# Altium project PPG_reconstruct.PrjPcb
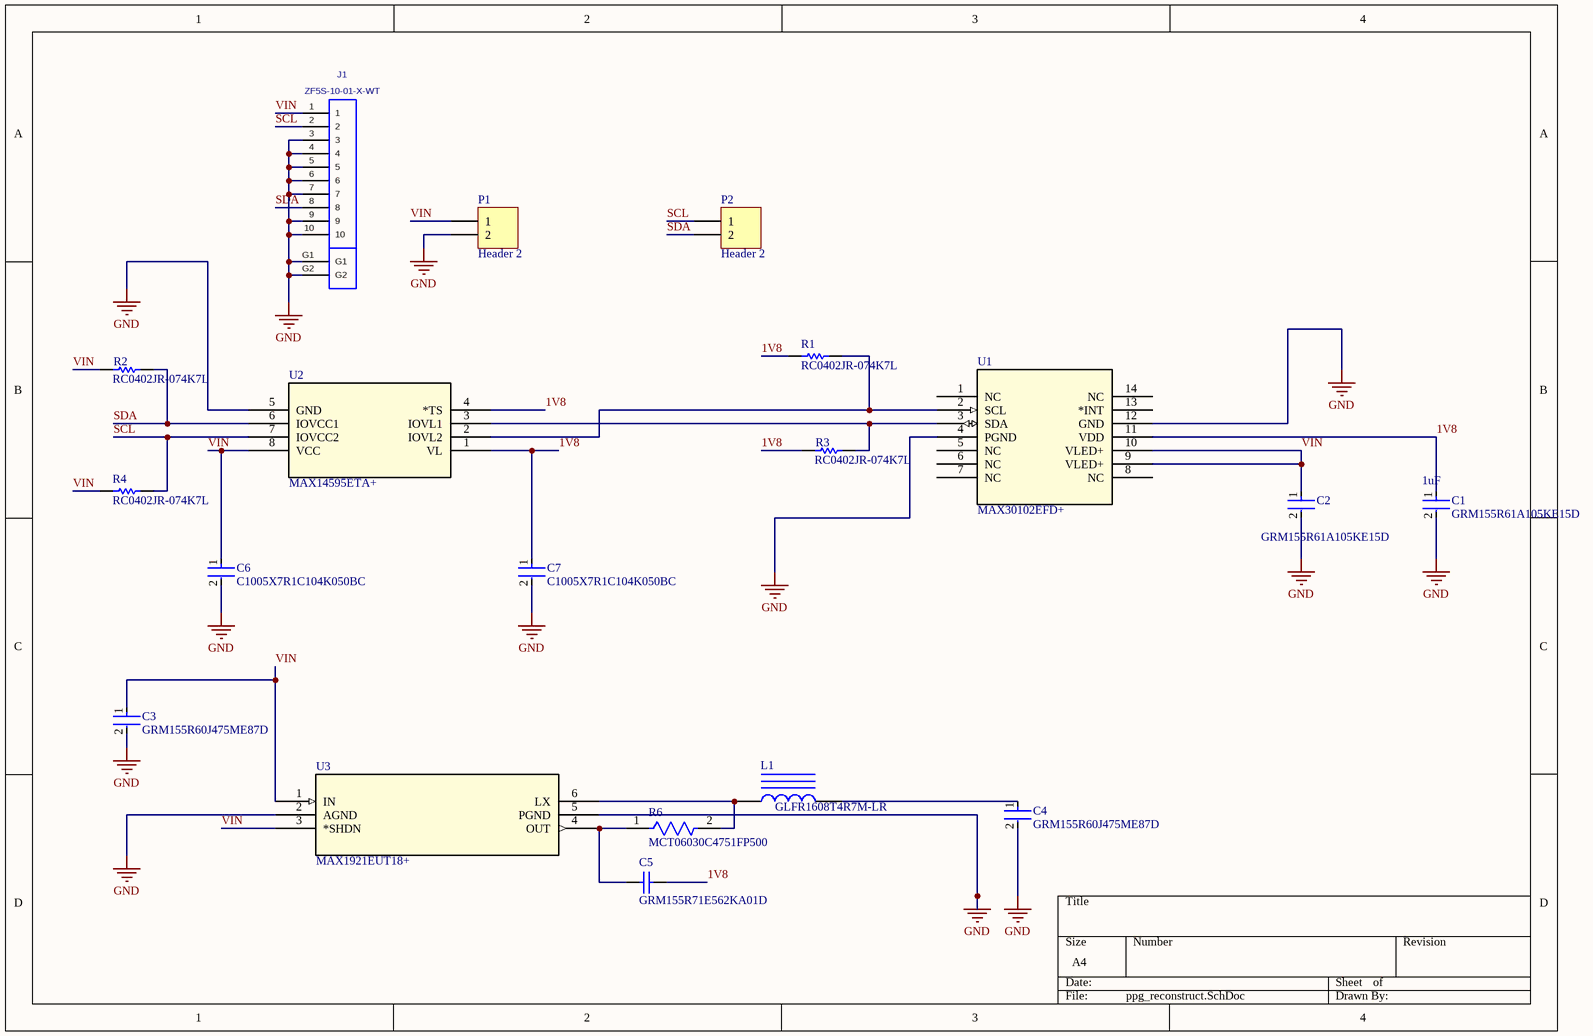
[diagram p0: ppg_reconstruct.SchDoc]
1 sheet, 19 parts. Net scope: global (net labels, ports and power ports of the same name join across sheets).
Board file: ppg_reconstruct.PcbDoc

## Sheet ppg_reconstruct.SchDoc
size A4; SheetNumber: 1; SheetTotal: 1

### Parts
C1  GRM155R61A105KE15D  value 1uF  [FP-GRM15-0_1-MFG]
C2  GRM155R61A105KE15D  [FP-GRM15-0_1-MFG]
C3  GRM155R60J475ME87D  [FP-GRM155-0_15-MFG]
C4  GRM155R60J475ME87D  [FP-GRM155-0_15-MFG]
C5  GRM155R71E562KA01D  [CAPC1005X55X25ML05T10]
C6  C1005X7R1C104K050BC  [FP-C1005-050-0_05-MFG]
C7  C1005X7R1C104K050BC  [FP-C1005-050-0_05-MFG]
J1  ZF5S-10-01-X-WT  [ZF5S-10-01-X-WT]
L1  GLFR1608T4R7M-LR  [INDC1608X100X35LL20T15]
P1  Header 2  [HDR1X2]
P2  Header 2  [HDR1X2]
R1  RC0402JR-074K7L  [RESC1005X40X25LL05T10]
R2  RC0402JR-074K7L  [RESC1005X40X25LL05T10]
R3  RC0402JR-074K7L  [RESC1005X40X25LL05T10]
R4  RC0402JR-074K7L  [RESC1005X40X25LL05T10]
R6  MCT06030C4751FP500  [FP-MCT0603-IPC_A]
U1  MAX30102EFD+  [21-1048_F143A5+1_MXM]
U2  MAX14595ETA+  [21-0487_T822CN+1_MXM]
U3  MAX1921EUT18+  [21-0058I_MXM]

### Nets
GND: C1.2 C2.2 C3.2 C4.2 C6.2 C7.2 J1.3 J1.4 J1.5 J1.6 J1.7 J1.9 J1.10 J1.G1 J1.G2 P1.2 U1.4(PGND) U1.12(GND) U2.5(GND) U3.2(AGND) U3.5(PGND)
1V8: C1.1 C5.2 C7.1 R1.1 R3.1 U1.11(VDD) U2.1(VL) U2.4(*TS)
SCL: J1.2 P2.1 R4.2 U2.7(IOVCC2)
SDA: J1.8 P2.2 R2.2 U2.6(IOVCC1)
VIN: C2.1 C3.1 C6.1 J1.1 P1.1 R2.1 R4.1 U1.9(VLED+) U1.10(VLED+) U2.8(VCC) U3.1(IN) U3.3(*SHDN)
NetC4_1: C4.1 L1.2
NetC5_1: C5.1 R6.1 U3.4(OUT)
NetL1_1: L1.1 R6.2 U3.6(LX)
NetR1_2: R1.2 U1.2(SCL) U2.2(IOVL2)
NetR3_2: R3.2 U1.3(SDA) U2.3(IOVL1)

Not connected (* = marked no-connect by the designer): U1 1(NC) 5(NC) 6(NC) 7(NC) 8(NC) 13(*INT) 14(NC)

### Library data of the parts
C1 C2 = CMP-2008-04556-2: CAP CER 1UF 10V X5R 0402; Manufacturer: Murata; Material: Ceramic; Tolerance: 10%; Temperature Coefficient: 15%; Octopart: https://octopart.com/grm155r61a105ke15d-murata-197442; Manufacturer Part Number: GRM155R61A105KE15D; Lead Free: Yes; ComponentLink2Description: Datasheet; Temperature: -55°C to +85°C; Temperature Range High: +85°C; Height: 0.55mm; Capacitance: 1uF; Ipc Land Pattern Name: CAPC10050X50; ComponentLink2URL: https://search.murata.co.jp/Ceramy/image/img/A01X/G101/ENG/GRM155R61A105KE15-01A.pdf; Temperature Range Low: -55°C; Device Class L2: Capacitors; Voltage Rating: 10V; RoHS: TRUE; Device Class L1: Passive Components; Device Class L3: Ceramic Capacitors; Temperature Characteristic: X5R; Mouser Description: 0402 1 uF 10 V ±10% Tolerance X5R Surface Mount Multilayer Ceramic Capacitor; Automotive: No; Package: GRM15-0.1; Digikey Description: CAP CER 1UF 10V X5R 0402; Category: Cap
  C2: Value: 1uF
C3 C4 = CMP-2008-04550-5: Chip Multilayer Ceramic Capacitors for General Purpose, 0402, 4.7uF, X5R, 15%, 20%, 6.3V; Packaging: Tape and Reel; REACH SVHC: No SVHC; Case Code (Metric): 1005; Case/Package: 0402; Series: GRM; Capacitance: 4.7uF; Construction: Flat; Min Operating Temperature: -55°C; Case Code (Imperial): 0402; Lead Free: Lead Free; Depth: 0.5mm; Height: 0.5mm; Tolerance: 20%; Voltage: 6.3V; Dielectric: X5R; Radiation Hardening: No; Voltage Rating: 6.3V; Max Operating Temperature: 85°C; Thickness: 0.022inch; Voltage Rating (DC): 6.3V; Package Quantity: 1; Width: 0.02inch; Mount: Surface Mount; Length: 1mm
C5 = CMP-2008-04631-1: Manufacturer: Murata; Part Number: GRM155R71E562KA01D
C6 C7 = CMP-08246-004182-1: Multilayer Ceramic Capacitors 100nF ±10% 16V X7R SMD 0402; Voltage: 16V; Depth: 0.5mm; Dielectric Material: Ceramic; Lead Free: Lead Free; Number of Pins: 2; Mount: Surface Mount; Radiation Hardening: No; Case/Package: 0402; Voltage Rating: 16V; Capacitance: 100nF; Dielectric: X7R; Min Operating Temperature: -55°C; RoHS Compliant: Yes; Tolerance: 10%; Voltage Rating (DC): 16V; Max Operating Temperature: 125°C; Case Code (Metric): 1005; Height: 0.5mm; Thickness: 0.022inch; Package Quantity: 1; Packaging: Tape and Reel; Termination: SMD/SMT; Construction: Flat; Resistor Type: Ceramic; Length: 1mm; Case Code (Imperial): 0402; Width: 0.02inch; Series: C; Weight: 2.3E-05oz
J1 = ZF5S-10-01-X-WT: ZERO INSERTION FORCE 0.5MM ASSEMBLY, 01 LEAD STYLE.; MANUFACTURER: SAMTEC; CREATED: January 30, 2015 - Wendy Xin; PCB DECAL: ZF5S-10-01-X-WT
L1 = CMP-2000-06322-1: Chip Inductor, 4.7 uH, +/- 20%, -40 to 105 degC, 0603 (1608 Metric), RoHS, Tape and Reel; Manufacturer: TDK; DC Resistance (DCR): 240mOhm; Dynamic Catalog: GLFRSeries; Catalog Drawings: 1608(0603)Top / 1608(0603)Side; Other Names: 445-3607-2; Inductance: 4.7µH; Other Related Documents: 1608(0603)Footprint; Current Rating: 110mA; Shielding: Shielded; Current - Saturation: 170mA; Mounting Technology: SurfaceMount; Manufacturer URL: http://www.tdk.com/; Family: FixedInductors; Datasheet URL: http://media.digikey.com/pdf/Data%20Sheets/TDK%20PDFs/GLFR%20Series.pdf; Package / Case: 0603(1608Metric); Package Description: 2-Pin Surface Mount Device, Body 1.6 x 0.8 mm; Standard Package: 4,000; Mounting Type: SurfaceMount; Category: Inductors,Coils,Chokes; Series: GLFR; Datasheet Version: 07/2008; Operating Temperature: -40°C~105°C; Package Reference: 0603; Packaging: Tape&Reel(TR); Tolerance: ±20%; Size / Dimension: 0.063"Lx0.031"Wx0.031"H(1.60mmx0.80mmx0.80mm)
P1 P2 = Header 2: Header, 2-Pin; LatestRevisionDate: 17-Jul-2002; LatestRevisionNote: Re-released for DXP Platform.; Publisher: Altium Limited
R1-R4 = CMP-2002-08011-1: Manufacturer: Yageo / Phycomp; Part Number: RC0402JR-074K7L
R6 = CMP-02407-008681-1: RES SMD 100 OHM 1% 1/8W 0603; Resistance: 4.75kR; Max Power Dissipation: 125mW; Temperature Coefficient: 50ppm/°C; Case/Package: 0603; Military Standard: Not; Case Code (Metric): 1608; Min Operating Temperature: -55°C; Radiation Hardening: No; Depth: 0.85mm; Lead Free: Lead Free; Contact Plating: Tin; Composition: Thin Film; Tolerance: 1%; Width: 0.033inch; Max Operating Temperature: 125°C; Case Code (Imperial): 0603; Number of Terminations: 2; Package Quantity: 1; Length: 0.061inch; Height: 0.022inch; Packaging: Tape and Reel
U1 = MAX30102EFD+: No Description Available; Mfr_Name: Analog Devices Inc; Copyright: Copyright (C) 2023 Ultra Librarian. All rights reserved.; Manufacturer_Part_Number: MAX30102EFD+; RefDes: RefDes; Type: DEV
U2 = MAX14595ETA+: No Description Available; Mfr_Name: Analog Devices Inc; Copyright: Copyright (C) 2023 Ultra Librarian. All rights reserved.; Manufacturer_Part_Number: MAX14595ETA+; RefDes: RefDes; Type: DEV
U3 = MAX1921EUT18+: No Description Available; Mfr_Name: Analog Devices Inc; Copyright: Copyright (C) 2023 Ultra Librarian. All rights reserved.; Manufacturer_Part_Number: MAX1921EUT18+; RefDes: RefDes; Type: DEV